# Altium schematic sheet Chopper PMDC.SchDoc
size A3
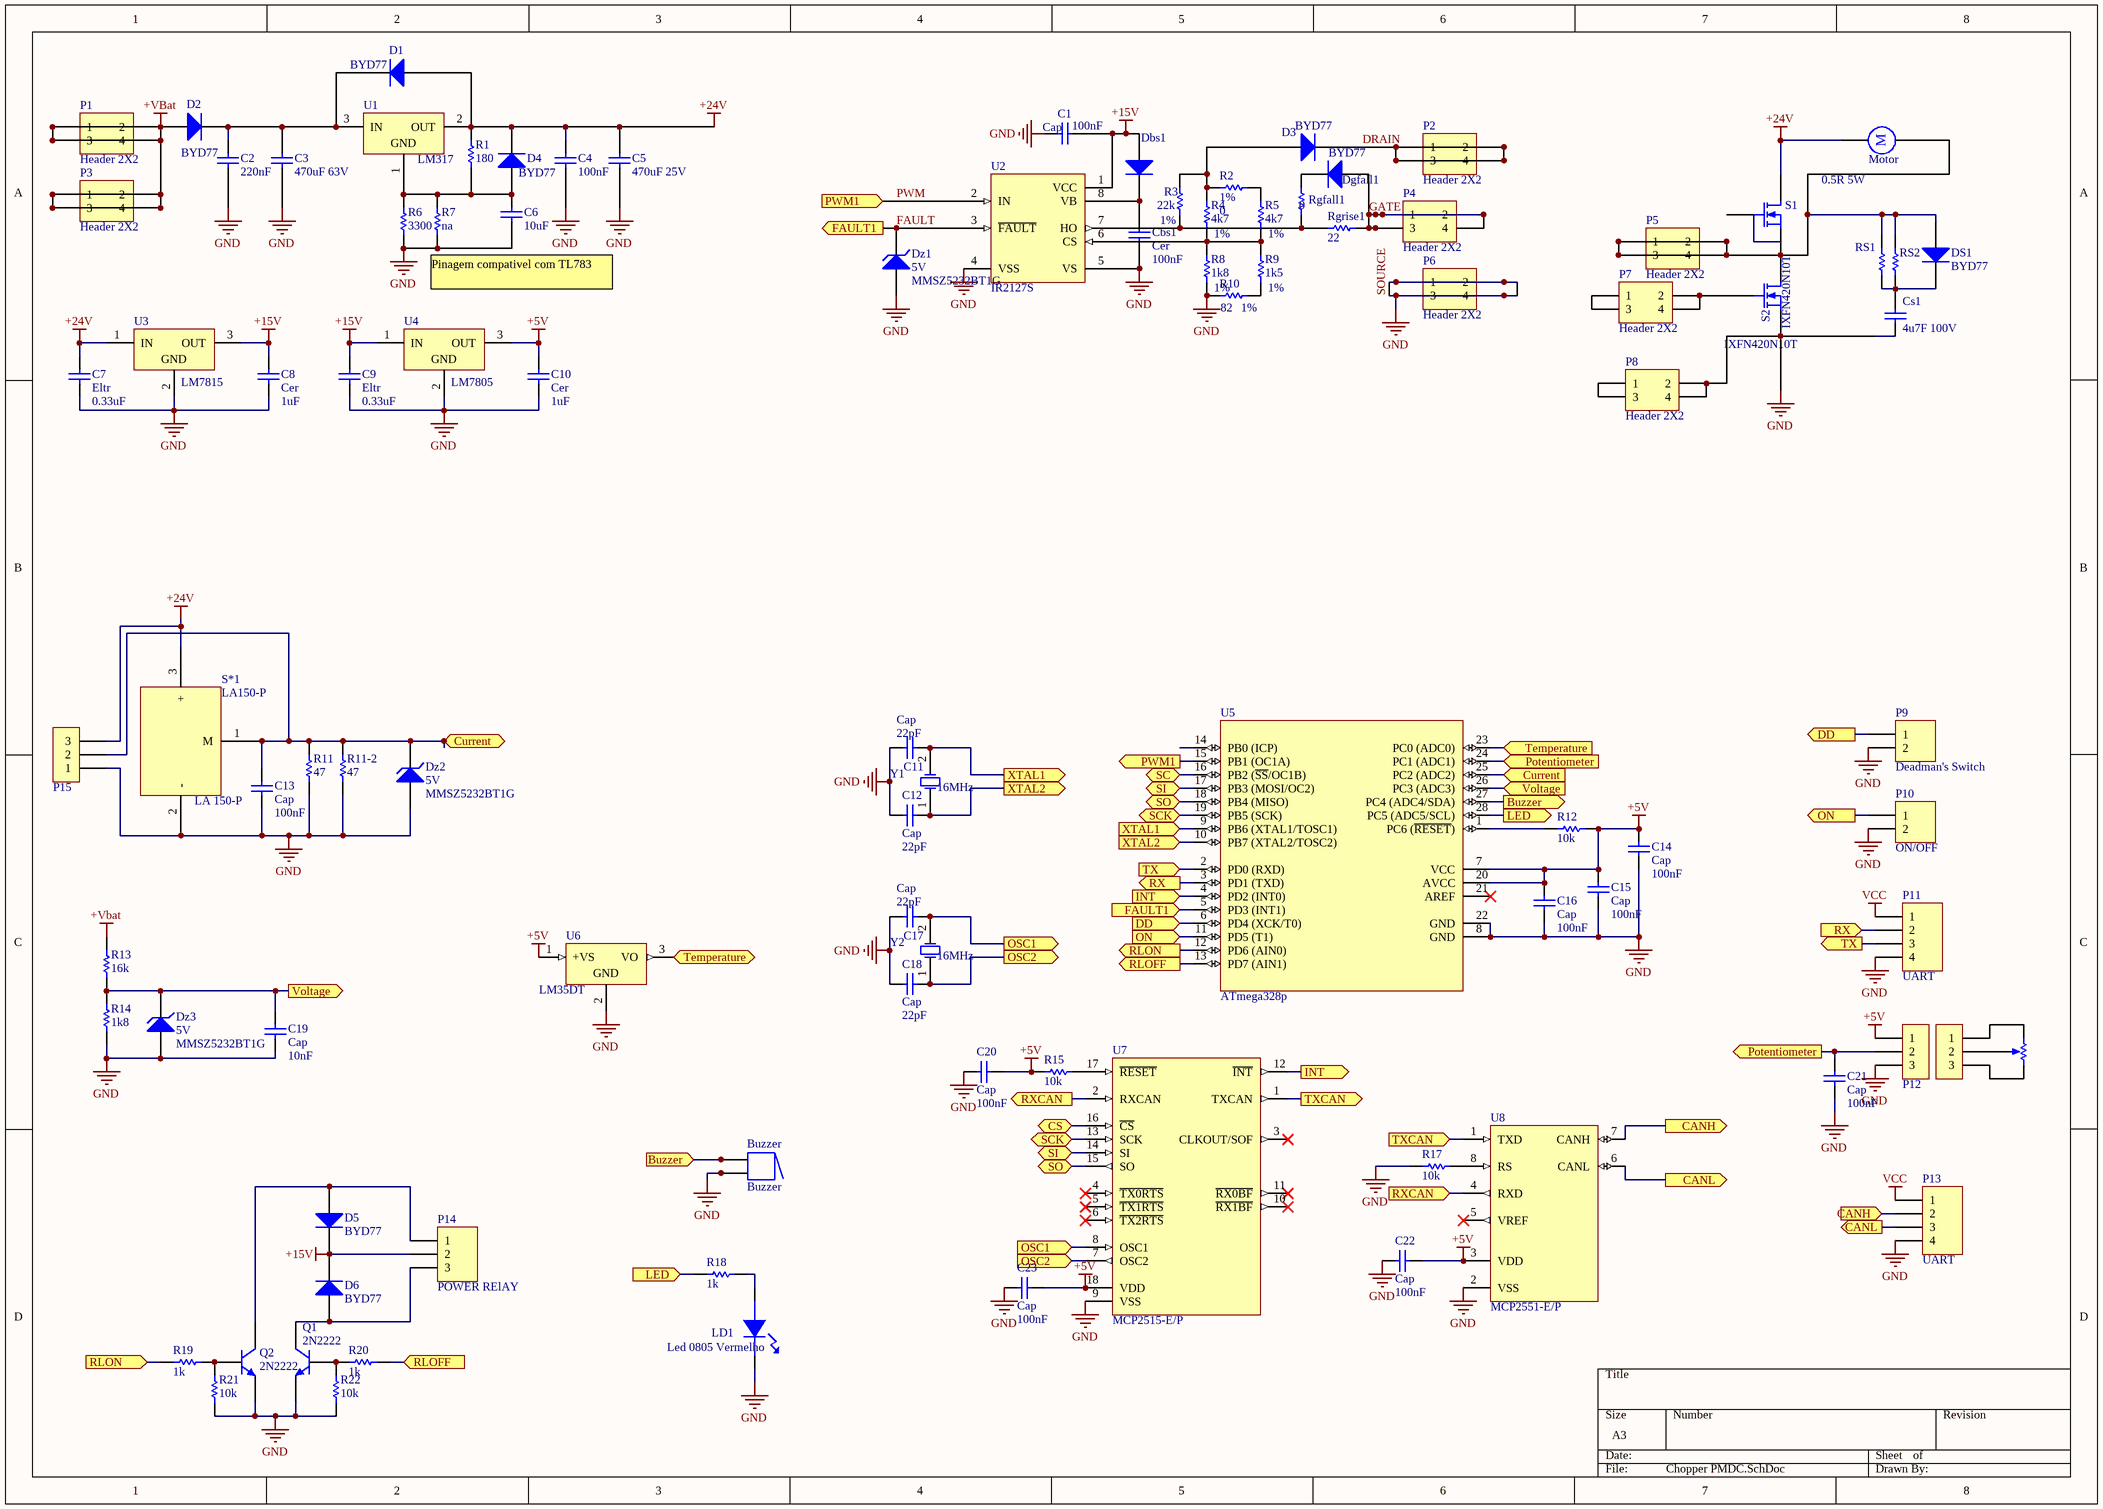
[diagram p0: Chopper PMDC.SchDoc]

## Parts
B?  Motor  [RB5-10.5]  (graphical)
Buzzer  Buzzer  [CapEltr-Rad4.1-Dpp3.0]
C1  Cap  value 100nF  [6-0805]
C2  value 220nF  [6-0805]  (hidden comment: Cap)
C3  value 470uF 63V  [CapEltr-Rad6.6-Dpp4.5]  (hidden comment: Cap)
C4  value 100nF  [6-0805]  (hidden comment: Cap)
C5  value 470uF 25V  [CapEltr-Rad4.1-Dpp3.0]  (hidden comment: Cap)
C6  value 10uF  [0805]  (hidden comment: Cap)
C7  Eltr  value 0.33uF  [6-0805]
C8  Cer  value 1uF  [1u25v]
C9  Eltr  value 0.33uF  [6-0805]
C10  Cer  value 1uF  [1u25v]
C11  Cap  value 22pF  [0805]
C12  Cap  value 22pF  [0805]
C13  Cap  value 100nF  [6-0805]
C14  Cap  value 100nF  [6-0805]
C15  Cap  value 100nF  [6-0805]
C16  Cap  value 100nF  [6-0805]
C17  Cap  value 22pF  [0805]
C18  Cap  value 22pF  [0805]
C19  Cap  value 10nF  [6-0805]
C20  Cap  value 100nF  [6-0805]
C21  Cap  value 100nF  [6-0805]
C22  Cap  value 100nF  [6-0805]
C23  Cap  value 100nF  [6-0805]
Cbs1  Cer  value 100nF  [C0805]
Cs1  value 4u7F 100V  [cap4u7]  (hidden comment: Cap)
D1  BYD77  [SOD87]
D2  value BYD77  [SOD87]  (hidden comment: Diode 1N4002)
D3  BYD77  [SOD87]
D4  value BYD77  [SOD87]  (hidden comment: 1N4002)
D5  value BYD77  [SOD87]  (hidden comment: 1N4002)
D6  value BYD77  [SOD87]  (hidden comment: 1N4002)
Dbs1  (no value)  [SOD87]
Dgfall1  BYD77  [SOD87]
DS1  BYD77  [SOD87]
Dz1  5V  value MMSZ5232BT1G  [diode-0.4]
Dz2  5V  value MMSZ5232BT1G  [diode-0.4]
Dz3  5V  value MMSZ5232BT1G  [DIODE-0.4]
LD1  value Led 0805 Vermelho  [6-0805]  (hidden comment: RED)
P1  Header 2X2  [HDR2X2]
P2  Header 2X2  [HDR2X2]
P3  Header 2X2  [HDR2X2]
P4  Header 2X2  [HDR2X2]
P5  Header 2X2  [HDR2X2]
P6  Header 2X2  [HDR2X2]
P7  Header 2X2  [HDR2X2]
P8  Header 2X2  [HDR2X2]
P9  Deadman's Switch  [HDR1X2]
P10  ON/OFF  [HDR1X2]
P11  UART  [HDR1X4]
P12  WE-Terminal Blocks Screw Type 691103110003  [t-block]  (value not drawn)
P13  UART  [HDR1X4]
P14  POWER RElAY  [HDR1X3]
P15  WE-Terminal Blocks Screw Type 691103110003  [hdr1x3]  (value not drawn)
P?  WE-Terminal Blocks Screw Type 691103110003  [691103110003]  (value not drawn)  (graphical)
Q1  2N2222  [22-03]
Q2  2N2222  [22-03]
R1  value 180  [6-0805]  (hidden comment: Res1)
R2  1%  value 0  [6-0805]
R3  1%  value 22k  [6-0805]
R4  1%  value 4k7  [6-0805]
R5  1%  value 4k7  [6-0805]
R6  value 3300  [6-0805]  (hidden comment: Res1)
R7  value na  [6-0805]  (hidden comment: Res1)
R8  1%  value 1k8  [6-0805]
R9  1%  value 1k5  [6-0805]
R10  1%  value 82  [6-0805]
R11  value 47  [6-0805]  (hidden comment: Res1)
R11-2  value 47  [6-0805]  (hidden comment: Res1)
R12  value 10k  [6-0805]  (hidden comment: Res1)
R13  value 16k  [6-0805]  (hidden comment: Res1)
R14  value 1k8  [6-0805]  (hidden comment: Res1)
R15  value 10k  [6-0805]  (hidden comment: Res1)
R17  value 10k  [6-0805]  (hidden comment: Res1)
R18  value 1k  [6-0805]  (hidden comment: Res1)
R19  value 1k  [6-0805]  (hidden comment: Res1)
R20  value 1k  [6-0805]  (hidden comment: Res1)
R21  value 10k  [6-0805]  (hidden comment: Res1)
R22  value 10k  [6-0805]  (hidden comment: Res1)
R?  RPot  [VR5]  (value not drawn)  (graphical)
Rgfall1  value 0  [6-0805]  (hidden comment: Res1)
Rgrise1  value 22  [6-0805]  (hidden comment: Res1)
RS1  Res1  [Axial 0.8]  (value not drawn)
RS2  value 0.5R 5W  [Axial 0.8]  (hidden comment: Res1)
S1  IXFN420N10T  [SOT-227B]  (value not drawn)
S2  IXFN420N10T  [SOT-227B]
S*1  LA150-P  [LA150-P]
U1  LM317  [TO-220AB]
U2  IR2127S  [SO8_M]
U3  LM7815  [TO-220AB]
U4  LM7805  [TO-220AB]
U5  ATmega328p  [28P3]
U6  LM35DT  [TA03F]
U7  MCP2515-E/P  [PDIP300-P18]
U8  MCP2551-E/P  [SOIC-SN8_L]
Y1  16MHz  [BCY-W2/E4.7]
Y2  16MHz  [BCY-W2/E4.7]

## Ports
Buzzer (in), Buzzer (out), CANH (in), CANH (out), CANL (out), CS (bidir), Current (in), Current (out), DD (in), DD (out), FAULT1 (in), FAULT1 (out), INT (in), INT (out), LED (in), LED (out), ON (in), ON (out), OSC1 (in), OSC1 (out), OSC2 (in), OSC2 (out), Potentiometer (in), Potentiometer (out), PWM1 (in), PWM1 (out), RLOFF (in), RLOFF (out), RLON (in), RLON (out), RX (in), RX (out), RXCAN (in), RXCAN (out), SC (bidir), SCK (bidir), SI (bidir), SO (bidir), Temperature (in), Temperature (out), TX (in), TX (out), TXCAN (in), TXCAN (out), Voltage (in), Voltage (out), XTAL1 (in), XTAL1 (out), XTAL2 (in), XTAL2 (out)

## Nets
+5V: C10.2 C14.1 C15.1 C16.1 C20.2 C22.2 C23.2 P12.1 R12.2 R15.1 U4.3(OUT) U5.7(VCC) U5.20(AVCC) U6.1(+VS) U7.18(VDD) U8.3(VDD)
+15V: C1.1 C8.2 C9.2 D5.2(K) D6.2(K) Dbs1.1(A) P14.2 U2.1(VCC) U3.3(OUT) U4.1(IN)
+24V: B?.1 C4.2 C5.2 C7.2 D1.1(A) D4.2(K) P15.3 R1.1 S1.1(D) S*1.3(+) U1.2(OUT) U3.1(IN)
+VBat: D2.1(A) P1.1 P1.2 P1.3 P1.4 P3.1 P3.2 P3.3 P3.4 R13.1
SOURCE: Buzzer.2 Buzzer.2A C1.2 C2.1 C3.1 C4.1 C5.1 C6.1 C7.1 C8.1 C9.1 C10.1 C11.1 C12.1 C13.2 C14.2 C15.2 C16.2 C17.1 C18.1 C19.2 C20.1 C21.2 C22.1 C23.1 Cbs1.1 Cs1.1 Dz1.1(A) Dz2.1(A) Dz3.1(A) LD1.2 P6.1 P6.2 P6.3 P6.4 P8.2 P8.4 P9.2 P10.2 P11.4 P12.3 P13.4 P15.1 Q1.1(E) Q2.1(E) R6.1 R7.1 R8.2 R10.1 R11.2 R11-2.2 R14.2 R17.1 R21.1 R22.1 S2.3(S) S*1.2(-) U2.4(VSS) U2.5(VS) U3.2(GND) U4.2(GND) U5.8(GND) U5.22(GND) U6.2(GND) U7.9(VSS) U8.2(VSS)  [also labelled GND]
VCC: P11.1 P13.1
Buzzer: Buzzer.1 Buzzer.1A U5.27(PC4_(ADC4/SDA)) ; port Buzzer
CANH: P13.2 U8.7(CANH) ; port CANH
CANL: P13.3 U8.6(CANL) ; port CANL
CS: U7.16(~{CS}) ; port CS
Current: C13.1 Dz2.2(K) P15.2 R11.1 R11-2.1 S*1.1(M) U5.25(PC2_(ADC2)) ; port Current
DD: P9.1 U5.6(PD4_(XCK/T0)) ; port DD
DRAIN: D3.2(K) P2.1 P2.2 P2.3 P2.4
FAULT: Dz1.2(K) U2.3(~{FAULT}) U5.5(PD3_(INT1)) ; port FAULT1
GATE: Dgfall1.1(A) P4.1 P4.2 P4.3 P4.4 Rgrise1.1
INT: U5.4(PD2_(INT0)) U7.12(~{INT}) ; port INT
LED: R18.2 U5.28(PC5_(ADC5/SCL)) ; port LED
ON: P10.1 U5.11(PD5_(T1)) ; port ON
OSC1: C17.2 U7.8(OSC1) Y2.2(OSC2) ; port OSC1
OSC2: C18.2 U7.7(OSC2) Y2.1(OSC1) ; port OSC2
Potentiometer: C21.1 P12.2 U5.24(PC1_(ADC1)) ; port Potentiometer
PWM: U2.2(IN) U5.15(PB1_(OC1A)) ; port PWM1
RLOFF: R20.2 U5.13(PD7_(AIN1)) ; port RLOFF
RLON: R19.1 U5.12(PD6_(AIN0)) ; port RLON
RX: P11.2 U5.3(PD1_(TXD)) ; port RX
RXCAN: U7.2(RXCAN) U8.4(RXD) ; port RXCAN
SC: U5.16(PB2_(~{SS}/OC1B)) ; port SC
SCK: U5.19(PB5_(SCK)) U7.13(SCK) ; port SCK
SI: U5.17(PB3_(MOSI/OC2)) U7.14(SI) ; port SI
SO: U5.18(PB4_(MISO)) U7.15(SO) ; port SO
Temperature: U5.23(PC0_(ADC0)) U6.3(VO) ; port Temperature
TX: P11.3 U5.2(PD0_(RXD)) ; port TX
TXCAN: U7.1(TXCAN) U8.1(TXD) ; port TXCAN
Voltage: C19.1 Dz3.2(K) R13.2 R14.1 U5.26(PC3_(ADC3)) ; port Voltage
XTAL1: C11.2 U5.9(PB6_(XTAL1/TOSC1)) Y1.2(OSC2) ; port XTAL1
XTAL2: C12.2 U5.10(PB7_(XTAL2/TOSC2)) Y1.1(OSC1) ; port XTAL2
NetB?_2: B?.2 DS1.1(A) P5.1 P5.2 P5.3 P5.4 RS1.2 RS2.2 S1.3(S) S2.1(D)
NetC2_2: C2.2 C3.2 D1.2(K) D2.2(K) U1.3(IN)
NetC6_2: C6.2 D4.1(A) R1.2 R6.2 R7.2 U1.1(ADJ)
NetCbs1_2: Cbs1.2 Dbs1.2(K) U2.8(VB)
NetCs1_2: Cs1.2 DS1.2(K) RS1.1 RS2.1
NetD3_1: D3.1(A) R2.1 R3.1 R4.1
NetD5_1: D5.1(A) P14.1 Q2.3(C)
NetD6_1: D6.1(A) P14.3 Q1.3(C)
NetDgfall1_2: Dgfall1.2(K) Rgfall1.1
NetLD1_1: LD1.1 R18.1
NetP7_1: P7.1 P7.3
NetP7_2: P7.2 P7.4 S2.2(G)
NetP8_1: P8.1 P8.3
NetP?_1: P?.1 R?.1(TOP)
NetP?_2: P?.2 R?.3(TAP)
NetP?_3: P?.3 R?.2(BOT)
NetQ1_2: Q1.2(B) R20.1 R22.2
NetQ2_2: Q2.2(B) R19.2 R21.2
NetR2_2: R2.2 R5.1
NetR3_2: R3.2 Rgfall1.2 Rgrise1.2 U2.7(HO)
NetR4_2: R4.2 R5.2 R8.1 R9.1 U2.6(CS)
NetR9_2: R9.2 R10.2
NetR12_1: R12.1 U5.1(PC6_(~{RESET}))
NetR15_2: R15.2 U7.17(~{RESET})
NetR17_2: R17.2 U8.8(RS)

Not connected (* = marked no-connect by the designer): S1 2(G); U5 14(PB0_(ICP)) 21(AREF)*; U7 3(CLKOUT/SOF)* 4(~{TX0RTS})* 5(~{TX1RTS})* 6(~{TX2RTS})* 10(~{RX1BF})* 11(~{RX0BF})*; U8 5(VREF)*

## Notes on the sheet
- Pinagem compativel com TL783
- (in symbol L7805ACV) GND
- (in symbol LA150-P) LA 150-P
- (in symbol Motor) M

## Library data of the parts
B? = Motor: Motor, General Kind; Published: 24-Mar-1999; LatestRevisionDate: 17-Jul-2002; LatestRevisionNote: Re-released for DXP Platform.; PackageReference: RB5-10.5; Publisher: Altium Limited; PackageDescription: Capacitor (Radial); 2 Leads
Buzzer = Buzzer: Magnetic Transducer Buzzer; pin to pad: 1A>1 2A>2; Published: 24-Mar-1999; LatestRevisionDate: 17-Dec-2003; LatestRevisionNote: Schematic revised, PCB Footprint replaced.; DatasheetVersion: 17-Dec-2003; PackageReference: ABSM-1574; Publisher: Altium Limited; ComponentLink1Description: Manufacturer Link; ComponentLink1URL: http://www.megastar.com/linecard/buzzmode/index.php
C1-C10 C13-C16 C19-C23 Cbs1 Cs1 = Cap: Capacitor; Published: 8-Jun-2000; LatestRevisionDate: 17-Jul-2002; LatestRevisionNote: Re-released for DXP Platform.; PackageReference: RAD-0.3; Publisher: Altium Limited; PackageDescription: Radial Cap, Thru-Hole; 2 Leads; 0.3 in Pin Spacing
C11 C12 C17 C18 = Cap Semi: Capacitor (Semiconductor SIM Model); Published: 8-Jun-2000; LatestRevisionDate: 29-May-2009; LatestRevisionNote: IPC-7351 Footprint Added.; PackageReference: C1206; Publisher: Altium Limited; PackageDescription: Chip Capacitor
D1-D6 Dgfall1 = Diode 1N4002: 1 Amp General Purpose Rectifier; pin to pad: 1>A 2>K
  D1: Published: 8-Jun-2000; LatestRevisionDate: 17-Jul-2002; LatestRevisionNote: Re-released for DXP Platform.; DatasheetVersion: 1998; PackageVersion: Aug-1999; PackageReference: DO-41; Publisher: Altium Limited; PackageDescription: Diode, Axial; Body 5.2 x 2.7 mm (LxDia. max), Lead Dia. 0.86 mm (max); Code_JEDEC: DO-204-AL; ComponentLink1Description: Manufacturer Link; ComponentLink1URL: http://www.fairchildsemi.com/; ComponentLink2Description: Datasheet; ComponentLink2URL: http://www.fairchildsemi.com/ds/1N%2F1N4001.pdf; value: BYD77
  D2 D4-D6: Published: 8-Jun-2000; LatestRevisionDate: 17-Jul-2002; LatestRevisionNote: Re-released for DXP Platform.; DatasheetVersion: 1998; PackageVersion: Aug-1999; PackageReference: DO-41; Publisher: Altium Limited; PackageDescription: Diode, Axial; Body 5.2 x 2.7 mm (LxDia. max), Lead Dia. 0.86 mm (max); Code_JEDEC: DO-204-AL; ComponentLink1Description: Manufacturer Link; ComponentLink1URL: http://www.fairchildsemi.com/; ComponentLink2Description: Datasheet; ComponentLink2URL: http://www.fairchildsemi.com/ds/1N%2F1N4001.pdf
  D3 Dgfall1: value: BYD77
Dbs1 = Diode 1N4002: 1 Amp General Purpose Rectifier; pin to pad: 1>A 2>K; value: BYD77
DS1 = Diode: Default Diode; pin to pad: 1>A 2>K; Published: 8-Jun-2000; LatestRevisionDate: 17-Jul-2002; LatestRevisionNote: Re-released for DXP Platform.; PackageVersion: Sep-1996; PackageReference: SMC; Publisher: Altium Limited; PackageDescription: DO-214-AB/SMC; 2 C-Bend Leads; Body 7.9 x 5.9 mm, inc. leads (LxW); Code_JEDEC: DO-214-AB; value: BYD77
Dz1-Dz3 = D Zener: Zener Diode
LD1 = LED: Diodo Emissor de Luz
P1-P8 = Header 2X2: Header, 2-Pin, Dual row; LatestRevisionDate: 17-Jul-2002; LatestRevisionNote: Re-released for DXP Platform.; Publisher: Altium Limited
P9 P10 = Header 2: Header, 2-Pin; LatestRevisionDate: 17-Jul-2002; LatestRevisionNote: Re-released for DXP Platform.; Publisher: Altium Limited
P11 P13 = Header 4: Header, 4-Pin; LatestRevisionDate: 17-Jul-2002; LatestRevisionNote: Re-released for DXP Platform.; Publisher: Altium Limited
P12 P15 P? = WE-Terminal Blocks Screw Type 691103110003: WR-TBL 3.50 mm Wire Protector system; Manufacturer: Würth Elektronik eiSos GmbH; ComponentLink1 Description: Manufacturer; ComponentLink2 Description: Datasheet; NoPins: 3; value: 3 pin Screw Terminal Block; Created Date: 29 October 2013; partNo: 691103110003; ComponentLink1URL: http://www.we-online.com; ComponentLink2URL: http://katalog.we-online.de/em/datasheet/6911031100xx.pdf; Created by: Karrer Zheng
P14 = Header 3: Header, 3-Pin; LatestRevisionDate: 17-Jul-2002; LatestRevisionNote: Re-released for DXP Platform.; Publisher: Altium Limited
Q1 Q2 = 2N2222: General Purpose Transistor NPN Silicon; Published: 29-Sep-2000; LatestRevisionDate: 17-Jul-2002; LatestRevisionNote: Re-released for DXP Platform.; DatasheetVersion: 1991; PackageVersion: 1997; PackageReference: 22-03; Publisher: Altium Limited; PackageDescription: Can; 3 Leads; Pin Circle Dia. 2.54 mm; Lead Dia. 0.48 mm (max); ComponentLink1Description: Manufacturer Link; ComponentLink1URL: http://www.onsemi.com/site/products/landing?taxonomyID=194
R1-R11 R11-2 R12-R15 R17-R22 Rgfall1 Rgrise1 RS1 RS2 = Res1: Resistor; Published: 8-Jun-2000; LatestRevisionDate: 17-Jul-2002; LatestRevisionNote: Re-released for DXP Platform.; PackageReference: AXIAL-0.3; Publisher: Altium Limited; PackageDescription: Axial Device, Thru-Hole; 2 Leads; 0.3 in Pin Spacing
R? = RPot: Potentiometer; Sim Note: Enter the Resistance value and the set point into parameter fields.; Set Position: 0.5; Value: 1K; Published: 8-Jun-2000; LatestRevisionDate: 17-Jul-2002; LatestRevisionNote: Re-released for DXP Platform.; PackageReference: VR5; Publisher: Altium Limited; PackageDescription: Variable Resistor, Thru-Hole; 3 Leads
S1 S2 = MOSFET-N: N-Channel MOSFET; pin to pad: 1>3 3>1; Published: 8-Jun-2000; LatestRevisionDate: 17-Jul-2002; LatestRevisionNote: Re-released for DXP Platform.; PackageVersion: 1995/1996; PackageReference: E3; Publisher: Altium Limited; PackageDescription: TO, Flat Index; 3 In-Line, Axial Leads; Body Dia. 4.6mm; Lead Dia. 0.5 mm (max); value: IXFN420N10T
S*1 = LA150-P: Current Transducer
U1 = L7805ACV: Precision 1A Regulator; Note: Tab is connected to pin 3 (GND).; value: LT783; Published: 24-Aug-2001; LatestRevisionDate: 17-Jul-2002; LatestRevisionNote: Re-released for DXP Platform.; DatasheetVersion: Nov-1999; PackageVersion: Jun-1998; PackageReference: TO220ABN; Publisher: Altium Limited; PackageDescription: TO, Thru-Hole, Vertical, Heatsink Mounted; 3 In-Line Leads; Pitch 2.54 mm; Pin sequence 1, 3, 2; ComponentLink1Description: Manufacturer Link; ComponentLink1URL: http://www.st.com/; ComponentLink2Description: Datasheet; ComponentLink2URL: http://www.st.com/stonline/products/literature/ds/2144/l7805ab.pdf
U2 = IR2127S: Current Sensing Single Channel Driver; Published: 8-Jun-2000; LatestRevisionDate: 13-Apr-2006; LatestRevisionNote: IPC-7351 Footprint Added.; DatasheetVersion: PD60143J; PackageVersion: Feb-2001; PackageReference: SO-8; Publisher: Altium Limited; PackageDescription: 8-Pin Plastic Small Outline Integrated Circuit 1.27 mm Pitch; Code_JEDEC: MS-012-AA; Code_IPC: SOIC127P600-8; ComponentLink1Description: Manufacturer Link; ComponentLink1URL: http://www.irf.com/; ComponentLink2Description: Datasheet; ComponentLink2URL: http://www.irf.com/product-info/datasheets/data/ir2127.pdf; value: IR2127S
U3 U4 = µA7805CKC: Positive-Voltage Regulator; Note: Pin 2 is electrically connected to TAB.; Published: 15-Apr-2002; DatasheetVersion: Jul-1999; PackageVersion: Sep-1995; PackageReference: KC03; Publisher: Altium Limited; PackageDescription: TO, Thru-Hole, Vertical, Heatsink Mounted; 3 In-Line Leads; Pitch 2.54 mm; ComponentLink1Description: Manufacturer Link; ComponentLink1URL: http://www.ti.com/; ComponentLink2Description: Datasheet; ComponentLink2URL: http://www-s.ti.com/sc/ds/ua7805.pdf
U5 = ATmega8-16PI: 8-Bit AVR Microcontroller with 8K Bytes of In-System Programmable Flash Memory; Published: 17-Sep-2003; LatestRevisionDate: 04-Mar-2005; LatestRevisionNote: Stylized 3D Model Added.; DatasheetVersion: 2486H-AVR-09/02; PackageVersion: revB, Sep-2001; PackageReference: 28P3; Publisher: Altium Limited; PackageDescription: DIP; 28 Leads; Row Spacing 7.62 mm; Pitch 2.54 mm; ComponentLink1Description: Manufacturer Link; ComponentLink1URL: http://www.atmel.com; ComponentLink2Description: Datasheet; ComponentLink2URL: http://www.atmel.com/dyn/resources/prod_documents/doc2486.pdf
U6 = LM35DT: Precision Centigrade Temperature Sensor; Manufacturer: National Semiconductor; CompType: Temp Sensor IC; PackageTopMarking: NSUZXYTTE#*LM35DT; PowerWise: N; Published: 4-Dec-2008; DatasheetVersion: Nov-2000; PackageVersion: revL, Jan-1993; PackageReference: TA03F; Publisher: Altium Limited; PackageDescription: TO-220, Molded, 3 Lead, Auto L/F; PartNumber: LM35DT; RoHS: O; PinCount: 3; DigiKeyPartNumber: LM35DT-ND; Code_JEDEC: TO-220-AB; ComponentLink1Description: LM35 Datasheet; ComponentLink1URL: http://www.national.com/ds/LM/LM35.pdf; ComponentLink2Description: LM35 Web Page; ComponentLink2URL: http://www.national.com/pf/LM/LM35.html; ComponentLink3Description: TA03F Package Page; ComponentLink3URL: http://www.national.com/packaging/folders/ta03f.html
U7 = MCP2515-E/P: Stand-Alone CAN Controller With SPI Interface, 18-Pin PDIP, Extended Temperature; FirstPublished: 29-Jan-2009; DatasheetVersion: revE, Nov-2007; PackageVersion: revBB, Aug-2009; PackageReference: PDIP300-P18; Publisher: Altium Limited; PackageDescription: 18-Lead Plastic Dual In-Line (P) - 300 mil Body [PDIP]; Supplier 1: Digi-Key; Supplier Part Number 1: MCP2515-E/P-ND; Supplier 2: Newark; Supplier Part Number 2: 29H7133; Code_JEDEC: MS-001; ComponentLink1Description: Datasheet; ComponentLink1URL: http://ww1.microchip.com/downloads/en/DeviceDoc/21801e.pdf; ComponentLink2Description: Packaging Specification; ComponentLink2URL: http://www.microchip.com/stellent/groups/techpub_sg/documents/packagingspec/en012702.pdf; ComponentLink3Description: Microchip.com Home; ComponentLink3URL: http://www.microchip.com/
U8 = MCP2551-E/P: High-Speed CAN Transceiver, 8-Pin PDIP, Extended Temperature; FirstPublished: 29-Jan-2009; DatasheetVersion: revE, Jan-2007; PackageVersion: revBB, Aug-2009; PackageReference: PDIP300-P8; Publisher: Altium Limited; PackageDescription: 8-Lead Plastic Dual In-Line (P) - 300 mil Body [PDIP]; Supplier 1: Digi-Key; Supplier Part Number 1: MCP2551-E/P-ND; Supplier 2: Farnell; Supplier Part Number 2: 1439745; Supplier 3: Newark; Supplier Part Number 3: 69K7603; Code_JEDEC: MS-001; ComponentLink1Description: Datasheet; ComponentLink1URL: http://ww1.microchip.com/downloads/en/DeviceDoc/21667E.pdf; ComponentLink2Description: Packaging Specification; ComponentLink2URL: http://www.microchip.com/stellent/groups/techpub_sg/documents/packagingspec/en012702.pdf; ComponentLink3Description: Microchip.com Home; ComponentLink3URL: http://www.microchip.com/
Y1 Y2 = XTAL: Crystal Oscillator; Published: 8-Jun-2000; LatestRevisionDate: 17-Jul-2002; LatestRevisionNote: Re-released for DXP Platform.; PackageReference: R38; Publisher: Altium Limited